# Altium schematic sheet radio_low.SchDoc
size A3; PageSetup: Record=PageOptions|CenterHorizontal=True|CenterVertical=True|PrintScale=1.00|XCorrection=1.00|YCorrection=1.00|PrintKind=1|BorderSize=5000000|LeftOffset=0|BottomOffset=0|Orientation=2|PaperLength=1000|PaperWidth=1000|Scale=100|PaperSource=7|PrintQuality=-3|MediaType=1|DitherType=10|PrintScaleMode=1|PaperKind=A3|PaperIndex=8
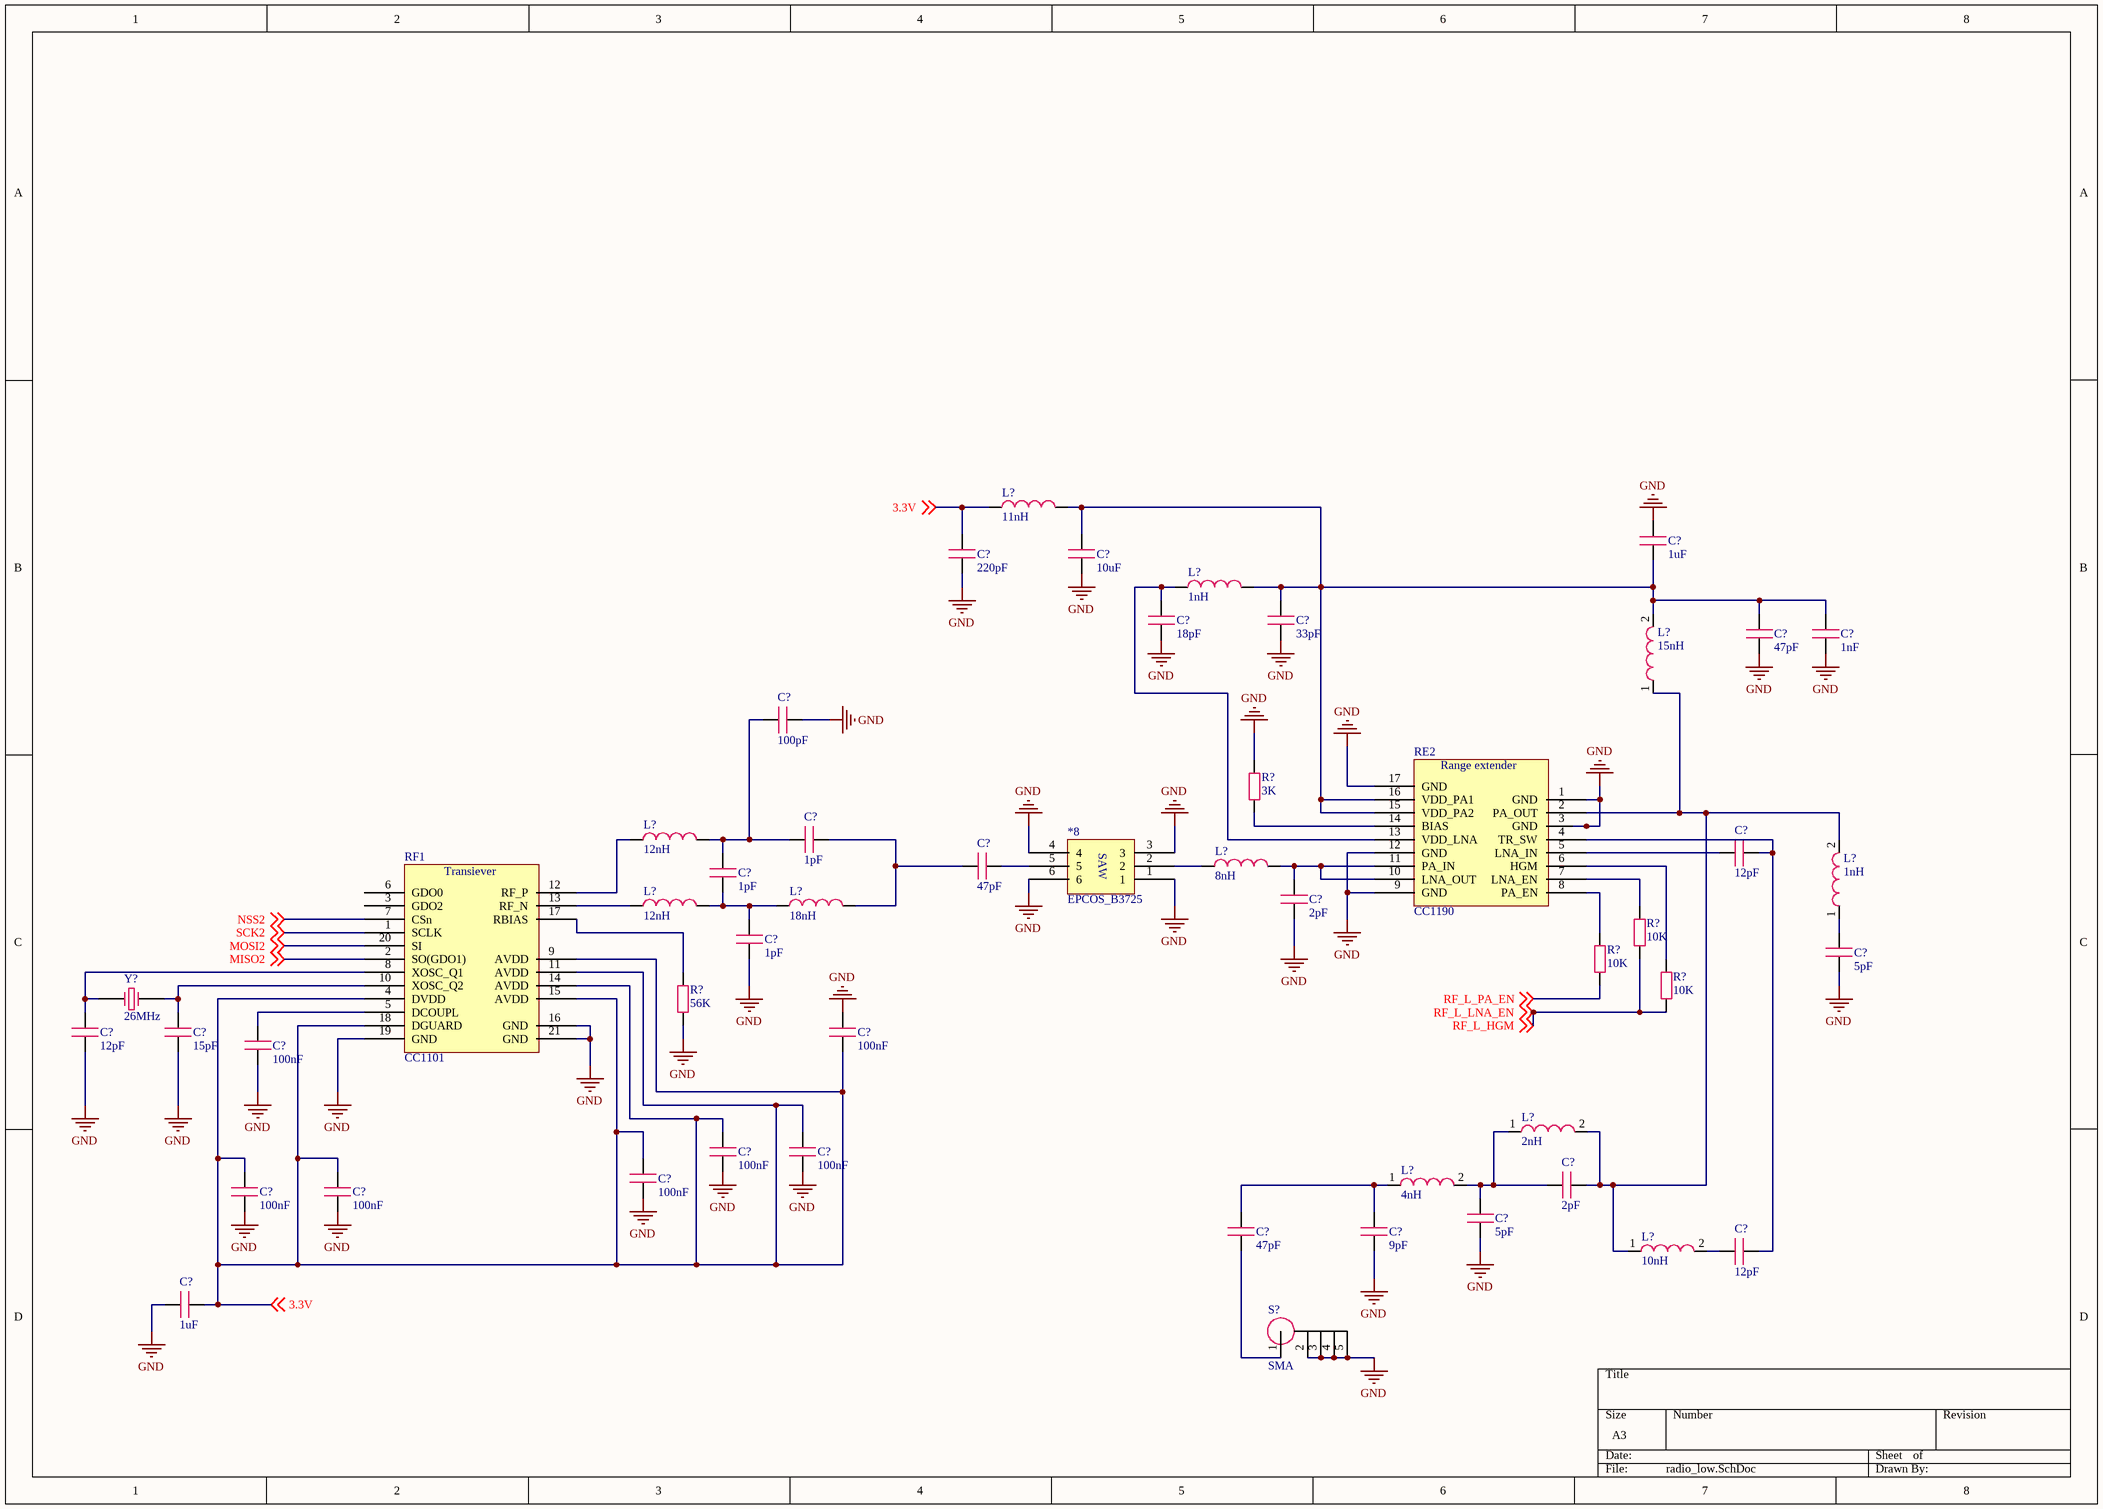
[diagram p0: radio_low.SchDoc]

## Parts
(Parts that share a designator on the sheet are numbered #1, #2 ... from top to bottom, then left to right.)
*8  EPCOS_B3725
C?#1  value 1uF  [C0402]  (hidden comment: Capacity)
C?#2  value 220pF  [C0402]  (hidden comment: Capacity)
C?#3  value 10uF  [C0402]  (hidden comment: Capacity)
C?#4  value 18pF  [C0402]  (hidden comment: Capacity)
C?#5  value 33pF  [C0402]  (hidden comment: Capacity)
C?#6  value 47pF  [C0402]  (hidden comment: Capacity)
C?#7  value 1nF  [C0402]  (hidden comment: Capacity)
C?#8  value 100pF  [C0402]  (hidden comment: Capacity)
C?#9  value 1pF  [C0402]  (hidden comment: Capacity)
C?#10  value 12pF  [C0402]  (hidden comment: Capacity)
C?#11  value 1pF  [C0402]  (hidden comment: Capacity)
C?#12  value 47pF  [C0402]  (hidden comment: Capacity)
C?#13  value 2pF  [C0402]  (hidden comment: Capacity)
C?#14  value 1pF  [C0402]  (hidden comment: Capacity)
C?#15  value 5pF  [C0402]  (hidden comment: Capacity)
C?#16  value 12pF  [C0402]  (hidden comment: Capacity)
C?#17  value 15pF  [C0402]  (hidden comment: Capacity)
C?#18  value 100nF  [C0402]  (hidden comment: Capacity)
C?#19  value 100nF  [C0402]  (hidden comment: Capacity)
C?#20  value 100nF  [C0402]  (hidden comment: Capacity)
C?#21  value 100nF  [C0402]  (hidden comment: Capacity)
C?#22  value 100nF  [C0402]  (hidden comment: Capacity)
C?#23  value 2pF  [C0402]  (hidden comment: Capacity)
C?#24  value 100nF  [C0402]  (hidden comment: Capacity)
C?#25  value 100nF  [C0402]  (hidden comment: Capacity)
C?#26  value 5pF  [C0402]  (hidden comment: Capacity)
C?#27  value 47pF  [C0402]  (hidden comment: Capacity)
C?#28  value 9pF  [C0402]  (hidden comment: Capacity)
C?#29  value 12pF  [C0402]  (hidden comment: Capacity)
C?#30  value 1uF  [C0402]  (hidden comment: Capacity)
L?#1  value 11nH  [L0402]  (hidden comment: Inductor)
L?#2  value 1nH  [L0402]  (hidden comment: Inductor)
L?#3  value 15nH  [L0402]  (hidden comment: Inductor)
L?#4  value 12nH  [L0402]  (hidden comment: Inductor)
L?#5  value 8nH  [L0402]  (hidden comment: Inductor)
L?#6  value 1nH  [L0402]  (hidden comment: Inductor)
L?#7  value 12nH  [L0402]  (hidden comment: Inductor)
L?#8  value 18nH  [L0402]  (hidden comment: Inductor)
L?#9  value 2nH  [L0402]  (hidden comment: Inductor)
L?#10  value 4nH  [L0402]  (hidden comment: Inductor)
L?#11  value 10nH  [L0402]  (hidden comment: Inductor)
R?#1  value 3K  [R0402]  (hidden comment: Resistor)
R?#2  value 10K  [R0402]  (hidden comment: Resistor)
R?#3  value 10K  [R0402]  (hidden comment: Resistor)
R?#4  value 10K  [R0402]  (hidden comment: Resistor)
R?#5  value 56K  [R0402]  (hidden comment: Resistor)
RE2  CC1190  [RGV16_2P16X2P16]
RF1  CC1101  [RGP20_2P4X2P4]
S?  SMA  [19-46-2_A]
Y?  Frequency: 26MHz  (hidden comment: Crystall)

## Nets
GND: *8.1 *8.3 *8.4 *8.6 C?#1.1 C?#2.2 C?#3.2 C?#4.2 C?#5.2 C?#6.2 C?#7.2 C?#8.2 C?#13.2 C?#14.1 C?#15.2 C?#16.2 C?#17.2 C?#18.1 C?#19.2 C?#20.2 C?#21.2 C?#22.2 C?#24.2 C?#25.2 C?#26.1 C?#28.1 C?#30.1 R?#1.2 R?#5.1 RE2.1(GND) RE2.3(GND) RE2.9(GND) RE2.12(GND) RE2.17(GND) RF1.16(GND) RF1.19(GND) RF1.21(GND) S?.2 S?.3 S?.4 S?.5
3.3V: C?#2.1 C?#18.2 C?#20.1 C?#21.1 C?#22.1 C?#24.1 C?#25.1 C?#30.2 L?#1.1 RF1.4(DVDD) RF1.9(AVDD) RF1.11(AVDD) RF1.14(AVDD) RF1.15(AVDD) RF1.18(DGUARD) ; off-sheet 3.3V
MISO2: RF1.2(SO(GDO1)) ; off-sheet MISO2
MOSI2: RF1.20(SI) ; off-sheet MOSI2
NSS2: RF1.7(CSn) ; off-sheet NSS2
RF_L_HGM: R?#2.1 R?#4.1 ; off-sheet RF_L_HGM, off-sheet RF_L_LNA_EN  [also labelled RF_L_LNA_EN]
RF_L_PA_EN: R?#3.1 ; off-sheet RF_L_PA_EN
SCK2: RF1.1(SCLK) ; off-sheet SCK2
Net*8_2: *8.2 L?#5.1
Net*8_5: *8.5 C?#12.2
NetC?#1_2: C?#1.2 C?#3.1 C?#5.1 C?#6.1 C?#7.1 L?#1.2 L?#2.2 L?#3.2 RE2.15(VDD_PA2) RE2.16(VDD_PA1)
NetC?#4_1: C?#4.1 L?#2.1 RE2.13(VDD_LNA)
NetC?#8_1: C?#8.1 C?#9.1 C?#11.2 L?#4.2
NetC?#9_2: C?#9.2 C?#12.1 L?#8.2
NetC?#10_1: C?#10.1 RE2.5(LNA_IN)
NetC?#10_2: C?#10.2 C?#29.2 RE2.4(TR_SW)
NetC?#11_1: C?#11.1 C?#14.2 L?#7.2 L?#8.1
NetC?#13_1: C?#13.1 L?#5.2 RE2.10(LNA_OUT) RE2.11(PA_IN)
NetC?#15_1: C?#15.1 L?#6.1
NetC?#16_1: C?#16.1 RF1.8(XOSC_Q1) Y?.1(OSC1)
NetC?#17_1: C?#17.1 RF1.10(XOSC_Q2) Y?.2(OSC2)
NetC?#19_1: C?#19.1 RF1.5(DCOUPL)
NetC?#23_1: C?#23.1 C?#26.2 L?#9.1 L?#10.2
NetC?#23_2: C?#23.2 L?#3.1 L?#6.2 L?#9.2 L?#11.1 RE2.2(PA_OUT)
NetC?#27_1: C?#27.1 S?.1
NetC?#27_2: C?#27.2 C?#28.2 L?#10.1
NetC?#29_1: C?#29.1 L?#11.2
NetL?#4_1: L?#4.1 RF1.12(RF_P)
NetL?#7_1: L?#7.1 RF1.13(RF_N)
NetR?#1_1: R?#1.1 RE2.14(BIAS)
NetR?#2_2: R?#2.2 RE2.7(LNA_EN)
NetR?#3_2: R?#3.2 RE2.8(PA_EN)
NetR?#4_2: R?#4.2 RE2.6(HGM)
NetR?#5_2: R?#5.2 RF1.17(RBIAS)

Not connected (* = marked no-connect by the designer): RF1 3(GDO2) 6(GDO0)

## Notes on the sheet
- (in symbol CC1101) Transiever
- (in symbol CC1190) Range extender
- (in symbol EPCOS_B3725) SAW

## Library data of the parts
*8 = EPCOS_B3725: Saw filter
RE2 = CC1190: 900MHZ range extender
RF1 = CC1101: 900MHz transiever
S? = SMA: Antenna connector
Y? = Crystall: Epson TSX-3225 MHz Crystal